# Altium schematic sheet Sheet3.SchDoc
size A
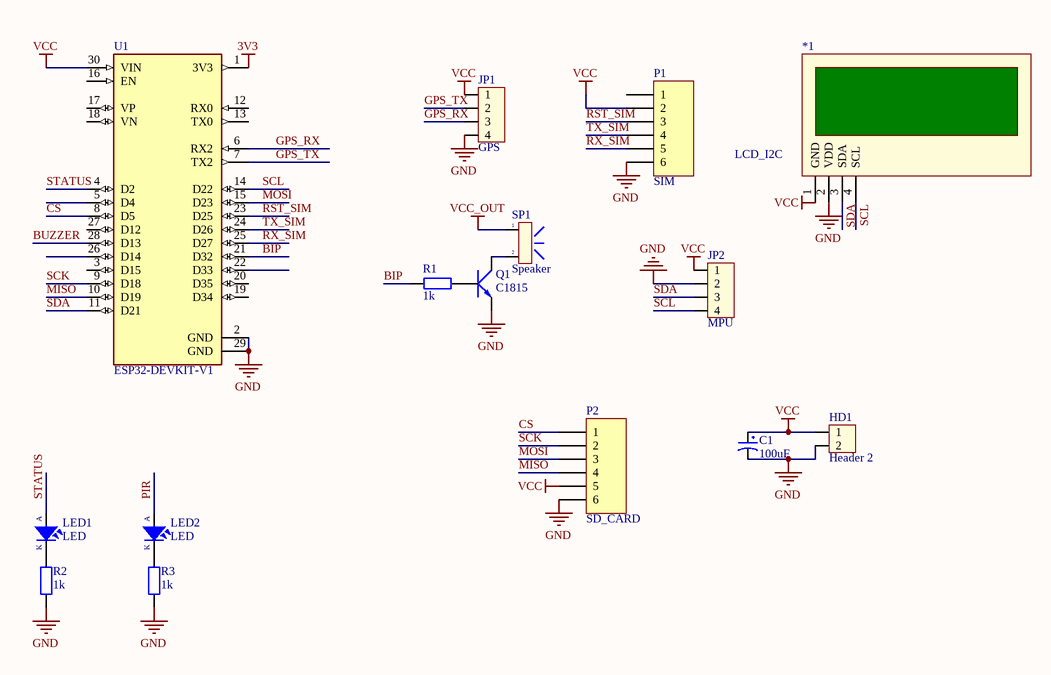
[diagram p0: Sheet3.SchDoc]

## Parts
*1  LCD_I2C  [LCD_I2C_2004]
C1  100uF  [CP1.5/3.4]
HD1  Header 2  [HED2]
JP1  GPS  [CON4]
JP2  MPU  [CON4]
LED1  LED  [LED-5]
LED2  LED  [LED-5]
P1  SIM  [HDR1X6]
P2  SD_CARD  [HDR1X6]
Q1  C1815  [QTO-92]
R1  1k  [R1/4W]
R2  1k  [R1/4W]
R3  1k  [R1/4W]
SP1  Speaker  [SPK]
U1  ESP32-DEVKIT-V1  [MODULE_ESP32_DEVKIT_V1]

## Nets
3V3: U1.1(3V3)
GND: *1.2(VDD) C1.2 HD1.2 JP1.4 JP2.2 P1.6 P2.6 Q1.1(E) R2.1 R3.1 U1.2(GND) U1.29(GND)
VCC: *1.1(GND) C1.1 HD1.1 JP1.1 JP2.1 P1.2 P2.5 U1.30(VIN)
VCC_OUT: SP1.1
BIP: R1.2 U1.21(D32)
BUZZER: U1.28(D13)
CS: P2.1 U1.8(D5)
GPS_RX: JP1.3 U1.6(RX2)
GPS_TX: JP1.2 U1.7(TX2)
MISO: P2.4 U1.10(D19)
MOSI: P2.3 U1.15(D23)
PIR: LED2.1(A)
RST_SIM: P1.3 U1.23(D25)
RX_SIM: P1.5 U1.25(D27)
SCK: P2.2 U1.9(D18)
SCL: *1.4(SCL) JP2.4 U1.14(D22)
SDA: *1.3(SDA) JP2.3 U1.11(D21)
STATUS: LED1.1(A) U1.4(D2)
TX_SIM: P1.4 U1.24(D26)
NetLED1_2: LED1.2(K) R2.2
NetLED2_2: LED2.2(K) R3.2
NetQ1_2: Q1.2(C) SP1.2
NetQ1_3: Q1.3(B) R1.1

Not connected (* = marked no-connect by the designer): P1 1; U1 3(D15) 5(D4) 12(RX0) 13(TX0) 16(EN) 17(VP) 18(VN) 19(D34) 20(D35) 22(D33) 26(D14) 27(D12)

## Library data of the parts
C1 = CP3: Cap 100uF/35V - 470uF/16V; Value: 100uF/35V/50V; Description 1: 1000uF/6,3V - 470uF/16V - 330uF - 25V; Description 2: 220uF/35V - 100uF/50V - 63V - 4,7uF/200V; Description 3: 22uF => 33uF100V - 3,3uF => 4,7uF/250V; Description 4: 2,2uF =>3,3uF/350 - 2,2uF/400V - 1uF/450V
HD1 = Hed2: Header 2 (Green); Value: Header 2
JP1 JP2 = Con4: Connector 4; Value: Connector 4
LED1 LED2 = LED: LED Single colour Green and Red; Value: LED 3 ly Single Colour
P1 P2 = Header 6: Header, 6-Pin; LatestRevisionDate: 17-Jul-2002; LatestRevisionNote: Re-released for DXP Platform.; Publisher: Altium Limited
Q1 = C1815: NPN 600mW, ECB; Value: C1815
R1-R3 = R1/4W: Resistor 1/4W; Value: R1/4W - 1K
SP1 = SPK: Speaker Chip; Value: Speaker Chip
U1 = ESP32-DEVKIT-V1: Dual core, Wi-Fi: 2.4 GHz up to 150 Mbits/s,BLE (Bluetooth Low Energy) and legacy Bluetooth, 32 bits, Up to 240 MHz; MF: Do it; SnapEDA_Link: https://www.snapeda.com/parts/ESP32-DEVKIT-V1/Do+it/view-part/?ref=snap; Package: None; Value: *; MP: ESP32-DEVKIT-V1; Check_prices: https://www.snapeda.com/parts/ESP32-DEVKIT-V1/Do+it/view-part/?ref=eda